# EAGLE design jalapino (EAGLE 7.5.0)
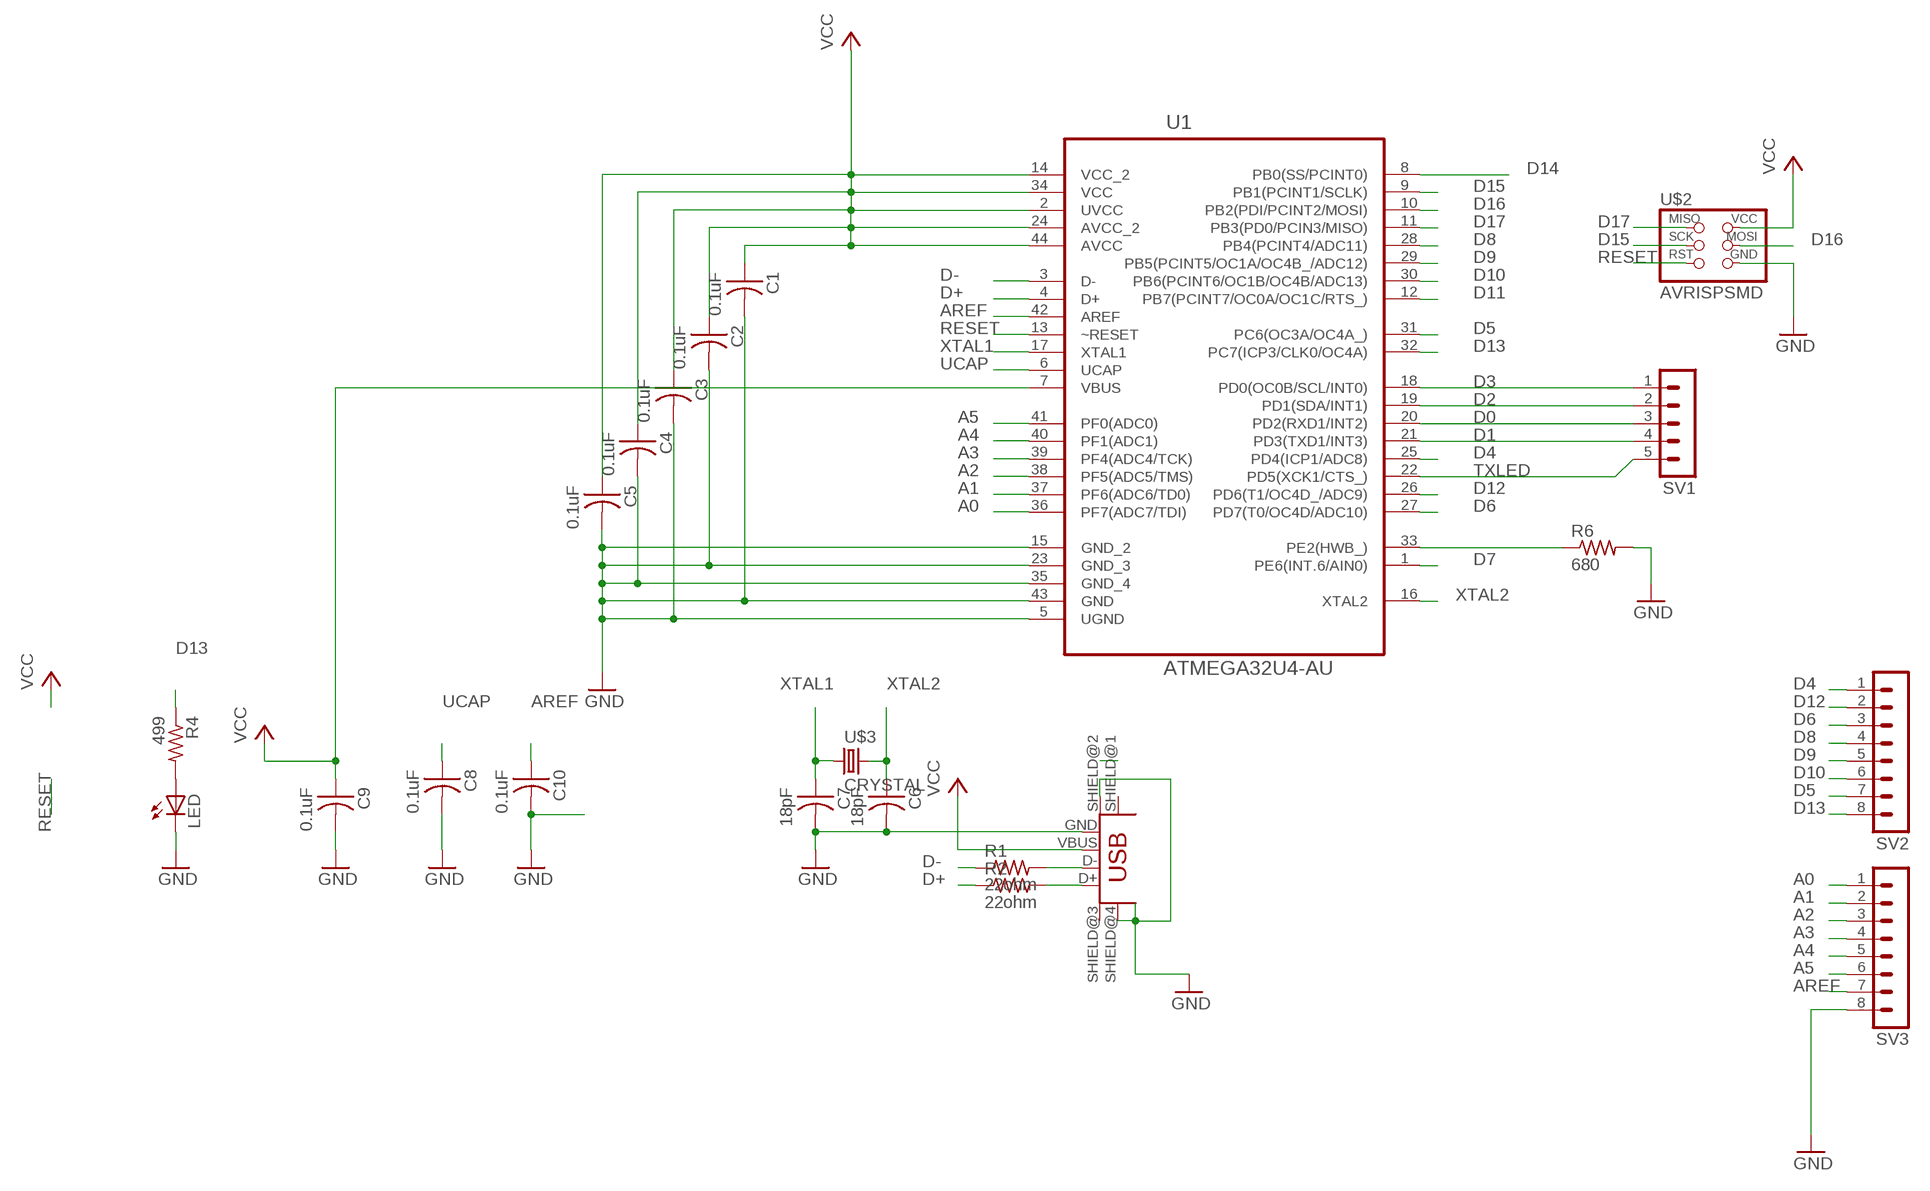
[diagram p0: schematic, sheet 1]

## Parts
C1  0.1uF  CAP-US1206FAB  [C1206FAB]
C2  0.1uF  CAP-US1206FAB  [C1206FAB]
C3  0.1uF  CAP-US1206FAB  [C1206FAB]
C4  0.1uF  CAP-US1206FAB  [C1206FAB]
C5  0.1uF  CAP-US1206FAB  [C1206FAB]
C6  18pF  CAP-US1206FAB  [C1206FAB]
C7  18pF  CAP-US1206FAB  [C1206FAB]
C8  0.1uF  CAP-US1206FAB  [C1206FAB]
C9  0.1uF  CAP-US1206FAB  [C1206FAB]
C10  0.1uF  CAP-US1206FAB  [C1206FAB]
LED  LED1206  [1206]
R1  22ohm  RES-US1206FAB  [R1206FAB]
R2  22ohm  RES-US1206FAB  [R1206FAB]
R4  499  RESISTOR1206  [1206]
R6  680  RES-US1206FAB  [R1206FAB]
SV1  MA05-1  [MA05-1]
SV2  MA08-1  [MA08-1]
SV3  MA08-1  [MA08-1]
U1  ATMEGA32U4-AU  [QFP80P1200X1200X120-44N]
U$1  USB_MINIB  [USB_MINIB]
U$2  AVRISPSMD  [2X03SMD]
U$3  CRYSTAL  [2-SMD-5X3MM]

## Nets
A0: SV3.1 U1.36(PF7(ADC7/TDI))
A1: SV3.2 U1.37(PF6(ADC6/TD0))
A2: SV3.3 U1.38(PF5(ADC5/TMS))
A3: SV3.4 U1.39(PF4(ADC4/TCK))
A4: SV3.5 U1.40(PF1(ADC1))
A5: SV3.6 U1.41(PF0(ADC0))
AREF: C10.1 SV3.7 U1.42(AREF)
D0: SV1.3 U1.20(PD2(RXD1/INT2))
D1: SV1.4 U1.21(PD3(TXD1/INT3))
D2: SV1.2 U1.19(PD1(SDA/INT1))
D3: SV1.1 U1.18(PD0(OC0B/SCL/INT0))
D4: SV2.1 U1.25(PD4(ICP1/ADC8))
D5: SV2.7 U1.31(PC6(OC3A/OC4A_))
D6: SV2.3 U1.27(PD7(T0/OC4D/ADC10))
D7: U1.1(PE6(INT.6/AIN0))
D8: SV2.4 U1.28(PB4(PCINT4/ADC11))
D9: SV2.5 U1.29(PB5(PCINT5/OC1A/OC4B_/ADC12))
D10: SV2.6 U1.30(PB6(PCINT6/OC1B/OC4B/ADC13))
D11: U1.12(PB7(PCINT7/OC0A/OC1C/RTS_))
D12: SV2.2 U1.26(PD6(T1/OC4D_/ADC9))
D13: R4.1 SV2.8 U1.32(PC7(ICP3/CLK0/OC4A))
D14: U1.8(PB0(SS/PCINT0))
D15: U1.9(PB1(PCINT1/SCLK)) U$2.3(SCK)
D16: U1.10(PB2(PDI/PCINT2/MOSI)) U$2.4(MOSI)
D17: U1.11(PB3(PD0/PCIN3/MISO)) U$2.1(MISO)
D+: R2.1 U1.4(D+)
D-: R1.1 U1.3(D-)
GND: C1.2 C2.2 C3.2 C4.2 C5.2 C6.2 C7.2 C8.2 C9.2 C10.2 LED.2(C) R6.2 SV3.8 U1.5(UGND) U1.15(GND_2) U1.23(GND_3) U1.35(GND_4) U1.43(GND) U$1.GND U$1.SHIELD@2(SHIELD1) U$1.SHIELD@4(SHIELD3) U$2.6(GND)
N$1: R1.2 U$1.D-
N$2: R2.2 U$1.D+
N$3: LED.1(A) R4.2
N$35: R6.1 U1.33(PE2(HWB_))
RESET: U1.13(~RESET) U$2.5(RST)
TXLED: SV1.5 U1.22(PD5(XCK1/CTS_))
UCAP: C8.1 U1.6(UCAP)
VCC: C1.1 C2.1 C3.1 C4.1 C5.1 C9.1 U1.2(UVCC) U1.7(VBUS) U1.14(VCC_2) U1.24(AVCC_2) U1.34(VCC) U1.44(AVCC) U$1.VBUS U$2.2(VCC)
XTAL1: C7.1 U1.17(XTAL1) U$3.P$1
XTAL2: C6.1 U1.16(XTAL2) U$3.P$2
Unconnected: U$1.SHIELD@1(SHIELD) U$1.SHIELD@3(SHIELD2)

## Library data of the parts
C1-C10 = fab:CAP-US
LED = ng:LED
R1 R2 R6 = fab:RES-US: Resistor (US Symbol) Variants with postfix FAB are widened to allow the routing of internal traces
R4 = ng:RESISTOR
SV1 = con-lstb:MA05-1: PIN HEADER; OC_FARNELL: unknown; OC_NEWARK: unknown
SV2 SV3 = con-lstb:MA08-1: PIN HEADER
U1 = Atmel_By_element14_Batch_1:ATMEGA32U4-AU: 8-bit Microcontroller with ISP Flash and USB Controller; MPN: ATMEGA32U4-AU; OC_FARNELL: 1748525; OC_NEWARK: 26R5633; PACKAGE: TQFP-44; SUPPLIER: Atmel
U$1 = fab:USB_MINIB
U$2 = fab:AVRISP
U$3 = fab:CRYSTAL

## Board
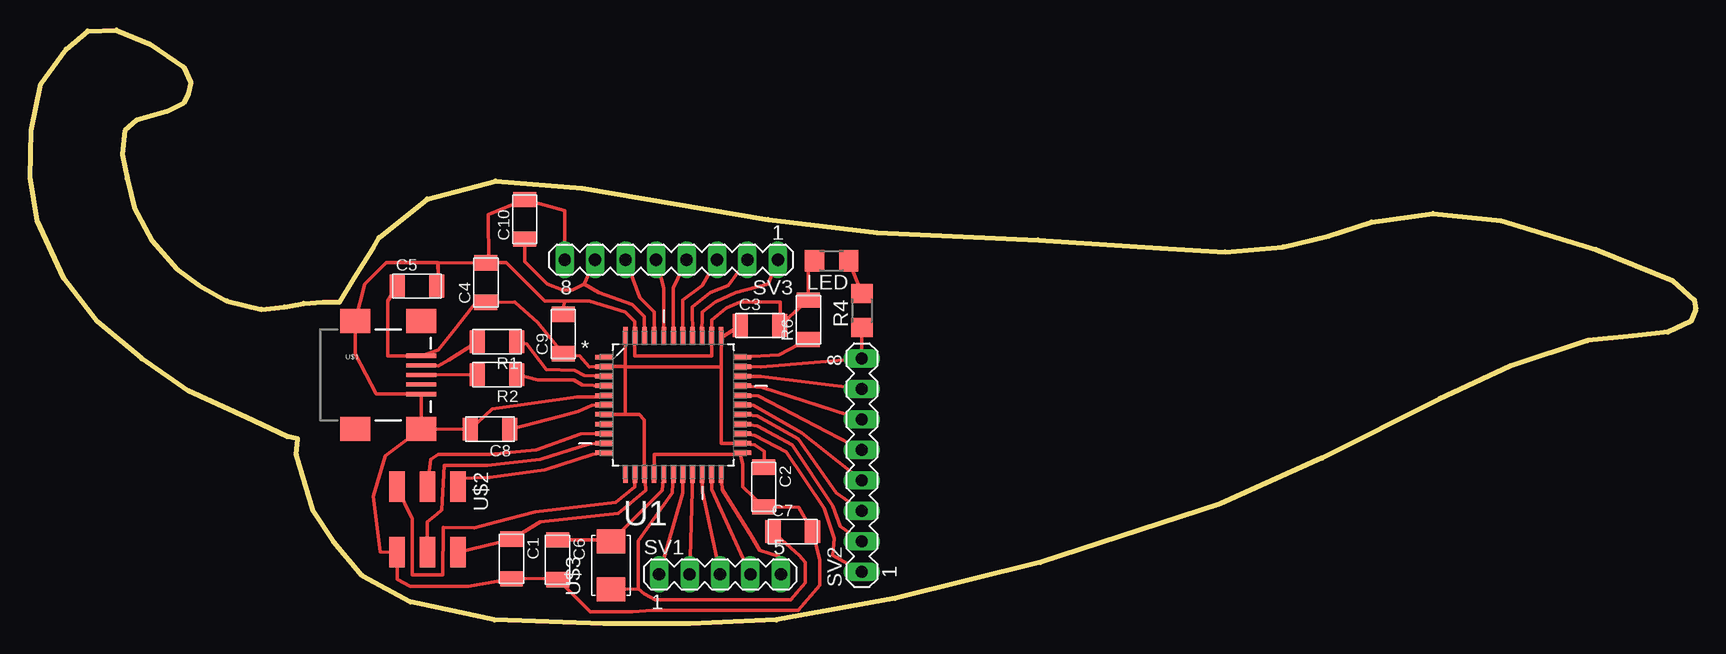
[diagram p1: board, top side]

Size 138.8 x 49.5 mm. Coordinates in mm from the lower left corner, seen from the top.
Outline: 29.1,32.2 33.1,35.4 38.8,36.9 46,36.3 61.5,33.7 70.6,32.6 84,32 94.2,31.3 99.6,31 104.4,31.4 108.2,32.3 111.8,33.5 116.9,34.2 122.6,33.6 130.5,31.2 136.9,28.6 138.7,27 138.8,26.2 138.4,25.2 136.5,24.3 133.6,24 129.8,23.6 123.4,21.5 117.4,18.7 107.7,13.8 99.2,10 84.2,5.1 72.1,2.1 62.2,0.3 55,0 47.8,0 38.7,0.3 31.7,1.8 27.7,4 25.3,6.8 23.6,9.4 22.2,14.1 22.3,15.4 21.4,15.6 18,17.2 13.2,19.4 9.3,22.1 5.6,25.2 2.8,28.8 0.6,33.6 0,37.2 0.1,41.1 0.9,45 3,47.9 4.8,49.4 7.2,49.5 10,48.3 12.8,46.4 13.4,45.1 13.2,44.2 12.8,43.4 11.4,42.7 8.9,42 7.9,41.1 7.7,39.1 8.1,37.1 8.7,34.7 10.2,31.9 12.2,29.6 14.1,28.2 16.4,26.9 19.3,26.2 21.2,26.4 22.8,26.7 24.4,26.8 25.8,26.8 27,28.8 28.6,31.3 29.1,32.2
Copper layers (1*16): Top 0.035mm / dielectric 1.5mm / Bottom 0.035mm
Design rules "default *": minimum track width 10mil, minimum drill 24mil, track to track 0.4mm, track to pad 0.4mm, pad to pad 0.4mm, via to via 0.4mm, smd to smd 0.4mm, copper to edge 40mil, drill to drill 0.4mm, minimum pad ring 10mil, minimum via ring 8mil, stop-mask expansion 4mil, vias tented up to drill 0mil, thermal gap 10mil

### Footprints (pad centres in the part's own frame; a part is rotated, then mirrored left to right if it is on the bottom)
C1206FAB = smd 1.27 x 1.905: 1 -1.651,0; 2 1.651,0
1206 = smd 1.6 x 1.803: 1 -1.422,0; 2 1.422,0
R1206FAB = smd 1.27 x 1.905: 1 -1.651,0; 2 1.651,0
MA05-1 = drill 1.016 long: 1 -5.08,0; 2 -2.54,0; 3 0,0; 4 2.54,0; 5 5.08,0
MA08-1 = drill 1.016 long: 1 -8.89,0; 2 -6.35,0; 3 -3.81,0; 4 -1.27,0; 5 1.27,0; 6 3.81,0; 7 6.35,0; 8 8.89,0
QFP80P1200X1200X120-44N = smd 1.5 x 0.38: 1 -5.74,3.988; 2 -5.74,3.2; 3 -5.74,2.388; 4 -5.74,1.6; 5 -5.74,0.787; 6 -5.74,0; 7 -5.74,-0.787; 8 -5.74,-1.6; 9 -5.74,-2.388; 10 -5.74,-3.2; 11 -5.74,-3.988; 23 5.74,-3.988; 24 5.74,-3.2; 25 5.74,-2.388; 26 5.74,-1.6; 27 5.74,-0.787; 28 5.74,0; 29 5.74,0.787; 30 5.74,1.6; 31 5.74,2.388; 32 5.74,3.2; 33 5.74,3.988 | smd 0.38 x 1.5: 12 -3.988,-5.74; 13 -3.2,-5.74; 14 -2.388,-5.74; 15 -1.6,-5.74; 16 -0.787,-5.74; 17 0,-5.74; 18 0.787,-5.74; 19 1.6,-5.74; 20 2.388,-5.74; 21 3.2,-5.74; 22 3.988,-5.74; 34 3.988,5.74; 35 3.2,5.74; 36 2.388,5.74; 37 1.6,5.74; 38 0.787,5.74; 39 0,5.74; 40 -0.787,5.74; 41 -1.6,5.74; 42 -2.388,5.74; 43 -3.2,5.74; 44 -3.988,5.74
USB_MINIB = smd 2.5 x 0.35: D+ 3.77,0; D- 3.77,0.8; GND 3.77,-1.6; ID 3.77,-0.8; VBUS 3.77,1.6 | smd 2.5 x 2: SHIELD@1 -1.73,-4.5; SHIELD@2 -1.73,4.5; SHIELD@3 3.77,4.5; SHIELD@4 3.77,-4.5
2X03SMD = smd 2.54 x 1.27: 1 -2.54,2.54; 2 2.92,2.54; 3 -2.54,0; 4 2.92,0; 5 -2.54,-2.54; 6 2.92,-2.54
2-SMD-5X3MM = smd 2 x 2.4: P$1 -2,0; P$2 2,0

### Placement (x,y rotation side)
C1  40.13,5.39 270 top
C2  61.14,11.39 270 top
C3  60.83,24.85 0 top
C4  37.98,28.43 90 top
C5  32.25,28.14 0 top
C6  43.97,5.32 270 top
C7  63.57,7.66 0 top
C8  38.33,16.2 180 top
C9  44.44,24.15 90 top
C10  41.23,33.7 90 top
LED  66.8,30.25 180 top
R1  38.92,23.5 180 top
R2  38.92,20.75 180 top
R4  69.32,26.1 90 top
R6  64.87,25.34 90 top
SV1  57.5,4.1 0 top
SV2  69.32,13.21 90 top
SV3  53.44,30.34 180 top
U1  53.61,18.23 0 top
U$1  28.83,20.73 0 top
U$2  33.12,8.87 270 top
U$3  48.42,4.87 90 top

### Tracks (layer width: path | path; a pad name or v marks a point on that pad's centre or on a via)
A0
  Top 0.305: U1.36 56,26 57.1,26.8 58.8,27.6 61.5,28.3 SV3.1
A1
  Top 0.305: U1.37 55.2,26.4 56.7,27.6 58.2,28.2 SV3.2
A2
  Top 0.305: U1.38 54.4,27 56,28.2 SV3.3
A3
  Top 0.305: U1.39 53.6,28 SV3.4
A4
  Top 0.305: U1.40 52.83,27.99 SV3.5
A5
  Top 0.305: U1.41 52,26 50.8,27.2 SV3.6
AREF
  Top 0.305: C10.1 41.23,30.17 43.1,28.3 44.4,27.8 45.2,27.8 46.2,28.3 | 46.2,28.3 SV3.7 | U1.42 51.2,25.6 50.2,26.6 47.4,27.6 46.2,28.3
D0
  Top 0.305: SV1.3 56,11.1 U1.20
D1
  Top 0.305: SV1.4 56.8,11.2 U1.21
D2
  Top 0.305: SV1.2 55.2,11.1 U1.19
D3
  Top 0.305: SV1.1 54.4,10.9 U1.18
D4
  Top 0.305: U1.25 60.4,15.7 63,14.3 66.2,9.6 67,7.1 66.9,5.7 SV2.1
D5
  Top 0.305: U1.31 60.9,20.6 SV2.7
D6
  Top 0.305: U1.27 60.6,17.3 64,15.4 67.2,10.9 SV2.3
D8
  Top 0.305: U1.28 60.3,18.2 64.3,15.9 SV2.4
D9
  Top 0.305: U1.29 60.7,19 SV2.5
D10
  Top 0.305: U1.30 61,19.7 SV2.6
D12
  Top 0.305: U1.26 60.6,16.5 63.5,14.9 66.9,9.8 67.5,8.1 SV2.2
D13
  Top 0.305: U1.32 60.9,21.4 SV2.8 R4.1
D15
  Top 0.305: U1.9 45.9,15.8 42.2,14.5 38.3,14.1 34,14.1 33.4,13.7 U$2.3
D16
  Top 0.305: U$2.4 33.1,8.5 33.9,9.1 34.3,9.5 34.5,13.2 38.1,13.2 42.5,13.7 46.6,15 U1.10
D17
  Top 0.305: U1.11 46.9,14.1 42.9,12.8 38.3,12.2 35.5,12.1 U$2.1
D+
  Top 0.305: U1.4 46,19.9 45.3,20.3 42.3,20.3 R2.1
D-
  Top 0.305: U1.3 46.2,20.7 45.4,21.1 43,21.2 41.4,23.3 R1.1
GND
  Top 0.305: SV3.8 44.56,34.44 C10.2 | 38.23,30.09 C4.2 39.7,30.1 42.9,26.9 44.5,26.9 | 38.23,30.09 38.2,34.1 C10.2 | 40.95,35.35 C10.2 | U1.5 47.99,18.9 45.6,18.9 38.5,17.9 C8.2 U$1.SHIELD@4 | U1.15 52,14.1 59.21,14.1 | U1.23 59.21,14.1 | 34,29 34,28.24 C5.2 | 44.5,26.9 46.6,26.9 49.6,26 50.4,25.2 U1.43 50.4,22.3 56.8,22.3 56.81,22.31 U1.35 56.8,25.3 58,26.3 59.2,26.8 62.5,26.8 C3.2 R6.2 64.86,30.18 LED.2 | 59.21,14.1 59.4,13.3 59.4,11.4 C2.2 64.08,9.68 C7.2 65.8,5.3 65.8,3.2 64,1.1 51.9,1.1 50.2,1 46.7,1 C6.2 43.4,3.76 C1.2 36.5,3.1 31.7,3.1 30.6,3.7 U$2.6 29.2,6 28.6,10.6 29.6,14 U$1.SHIELD@4 | U$1.SHIELD@4 U$1.GND 28.87,19.13 27.1,22.5 U$1.SHIELD@2 27.9,28.3 29.7,30.1 33.97,30.1 34,29 | C9.2 44.5,26.9 | 38.23,30.09 34.01,30.08 34,29
N$1
  Top 0.305: R1.2 34.9,22 34,21.5 U$1.D-
N$2
  Top 0.305: R2.2 U$1.D+
N$3
  Top 0.305: LED.1 R4.2
N$35
  Top 0.305: U1.33 62.4,22.4 R6.1
RESET
  Top 0.305: U1.13 50.4,11.4 48.8,10.1 42.1,9.3 38.9,8.5 37,8 34.43,8.02 34.41,4.05 31.84,4.05 31.84,8.74 U$2.5
TXLED
  Top 0.305: SV1.5 62.4,5.6 60.8,6.1 60.1,7.3 57.7,11.2 U1.22
UCAP
  Top 0.305: U1.6 46.8,18.2 45.7,17.7 44.3,17.3 C8.1
VCC
  Top 0.305: C3.1 57.69,23.88 U1.34 57.6,21.4 | 49.6,17.44 50.76,17.44 51.2,17 51.2,12.51 U1.14 51.3,11.1 49,9.2 42.5,8.5 C1.1 U$2.2 | 49.6,17.44 U1.7 | 57.6,21.4 49.6,21.4 | 49.6,21.43 49.6,23.97 U1.44 | U1.2 47.87,21.4 | 57.6,21.4 57.6,15.03 U1.24 60.4,14.9 61.17,14.36 C2.1 | 49.6,21.4 49.6,17.44 | 49.6,21.4 49.6,21.43 | 49.6,21.43 U1.2 | C5.1 29.8,26.9 29.8,22.3 32.6,22.3 U$1.VBUS 34,22.8 35.5,24.7 37.2,26.8 C4.1 40.4,26.8 42.3,25.1 C9.1 45.8,22.3 46.6,21.4 U1.2
XTAL1
  Top 0.305: C7.1 64.1,5.7 64.6,5.1 64.6,3.4 63.4,2 52.1,2 51.2,2.5 50.7,2.9 | 50.7,2.9 U$3.P$1 | 50.7,2.9 50.7,6.9 53.5,10.9 U1.17
XTAL2
  Top 0.305: U1.16 52.7,11.1 U$3.P$2 47.97,6.97 C6.1

### Text on the board
200bmp: C:/Users/LuizHenrique/Desktop/FabAcademy/_Final Project/myBoards/Jalapino/JLPINO_03.bmp
208bmp: C:/Users/LuizHenrique/Desktop/FabAcademy/_Final Project/myBoards/Jalapino/JLPINO_03.bmp
210bmp: C:/Users/LuizHenrique/Desktop/FabAcademy/_Final Project/myBoards/Jalapino/JLPINO_03.bmp